# Altium schematic sheet 01_ Title Page.SchDoc
size 420 x 297 mm; SheetNumber: 1; SheetTotal: 4
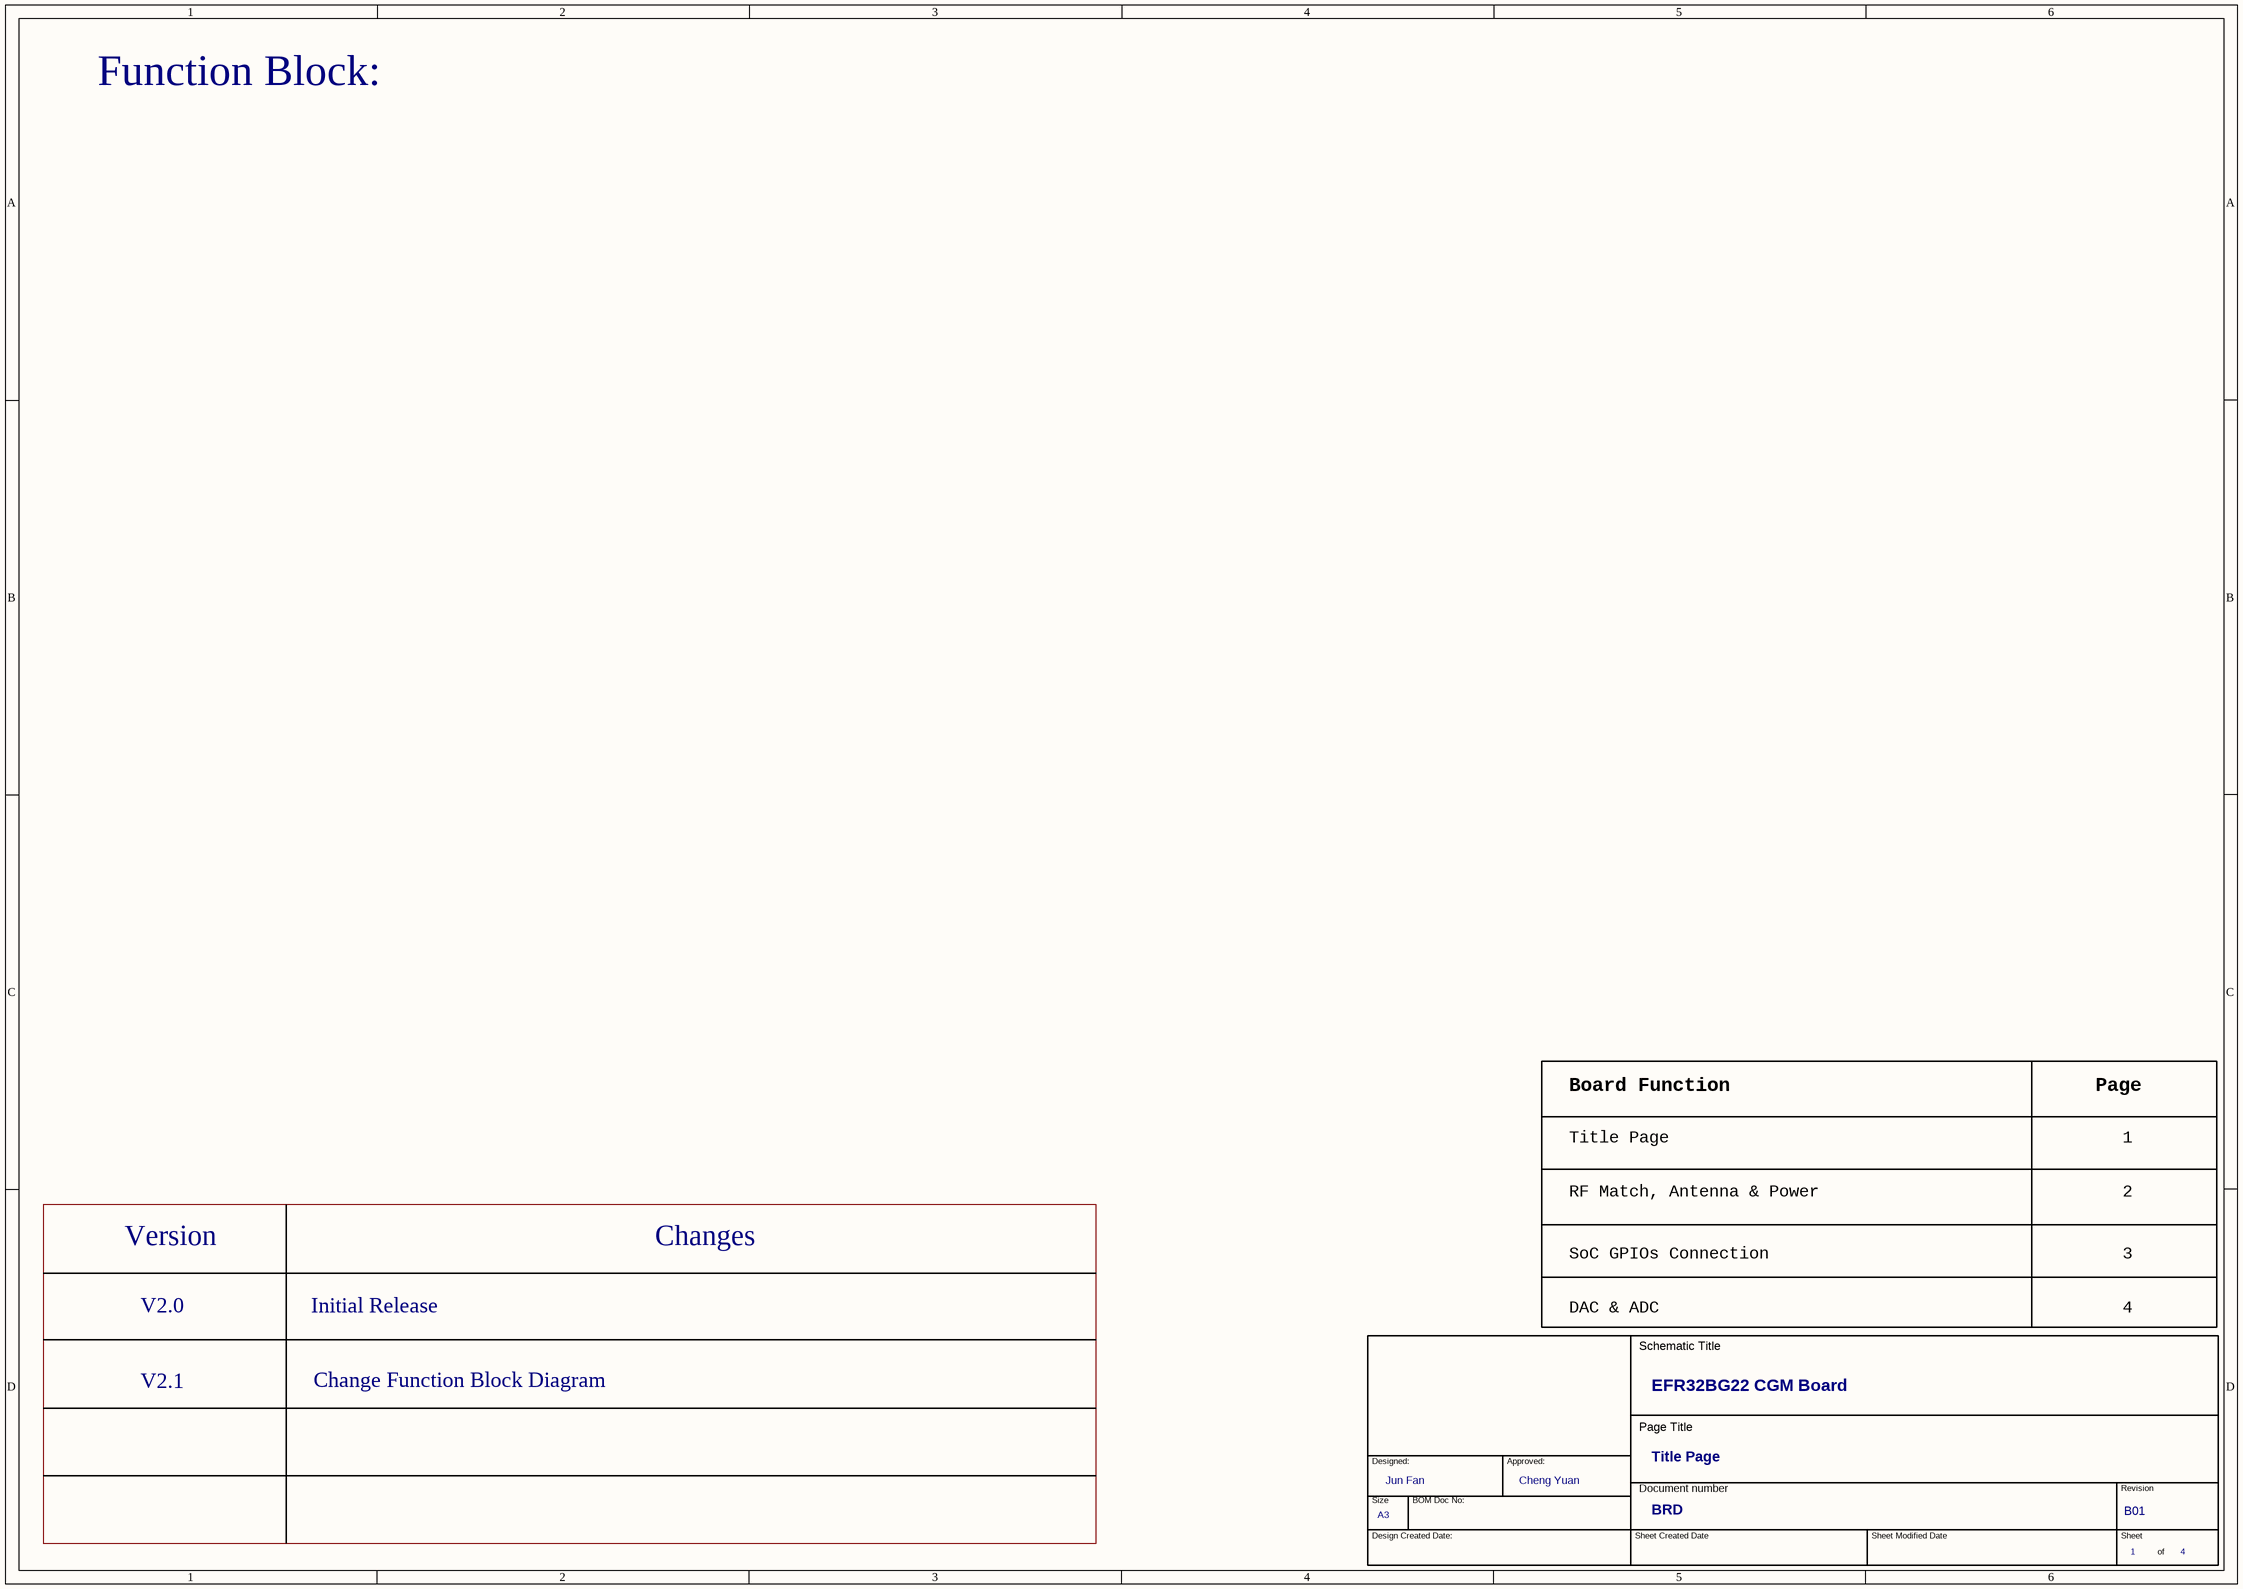
[diagram p0: 01_ Title Page.SchDoc]

## Parts
*?  OrgAddr2: Cheng Yuan  OrgAddr1: Jun Fan  Page Count: 4  Page Number: 1  Doc: BRD  Title: EFR32BG22 CGM Board  RevCode: B01  Page Size: A3  Page Title: Title Page  (hidden comment: TitleBlock_SiLabs_A3)  (graphical)

## Notes on the sheet
- Function Block:
- Board Function
- Page
- RF Match, Antenna & Power
- Title Page
- 1
- 2
- Version
- Changes
- SoC GPIOs Connection
- 3
- V2.0
- Initial Release
- DAC & ADC
- 4
- V2.1
- Change Function Block Diagram
- (in symbol TitleBlock_SiLabs_A3) Schematic Title; Page Title; Designed:; Approved:; Document number; Revision; Size; BOM Doc No:; Design Created Date:; Sheet Created Date; Sheet Modified Date; Sheet; of

## Library data of the parts
*? = TitleBlock_SiLabs_A3: Cage Code: <Cage Code>